# EAGLE design MAR (EAGLE 5.11)
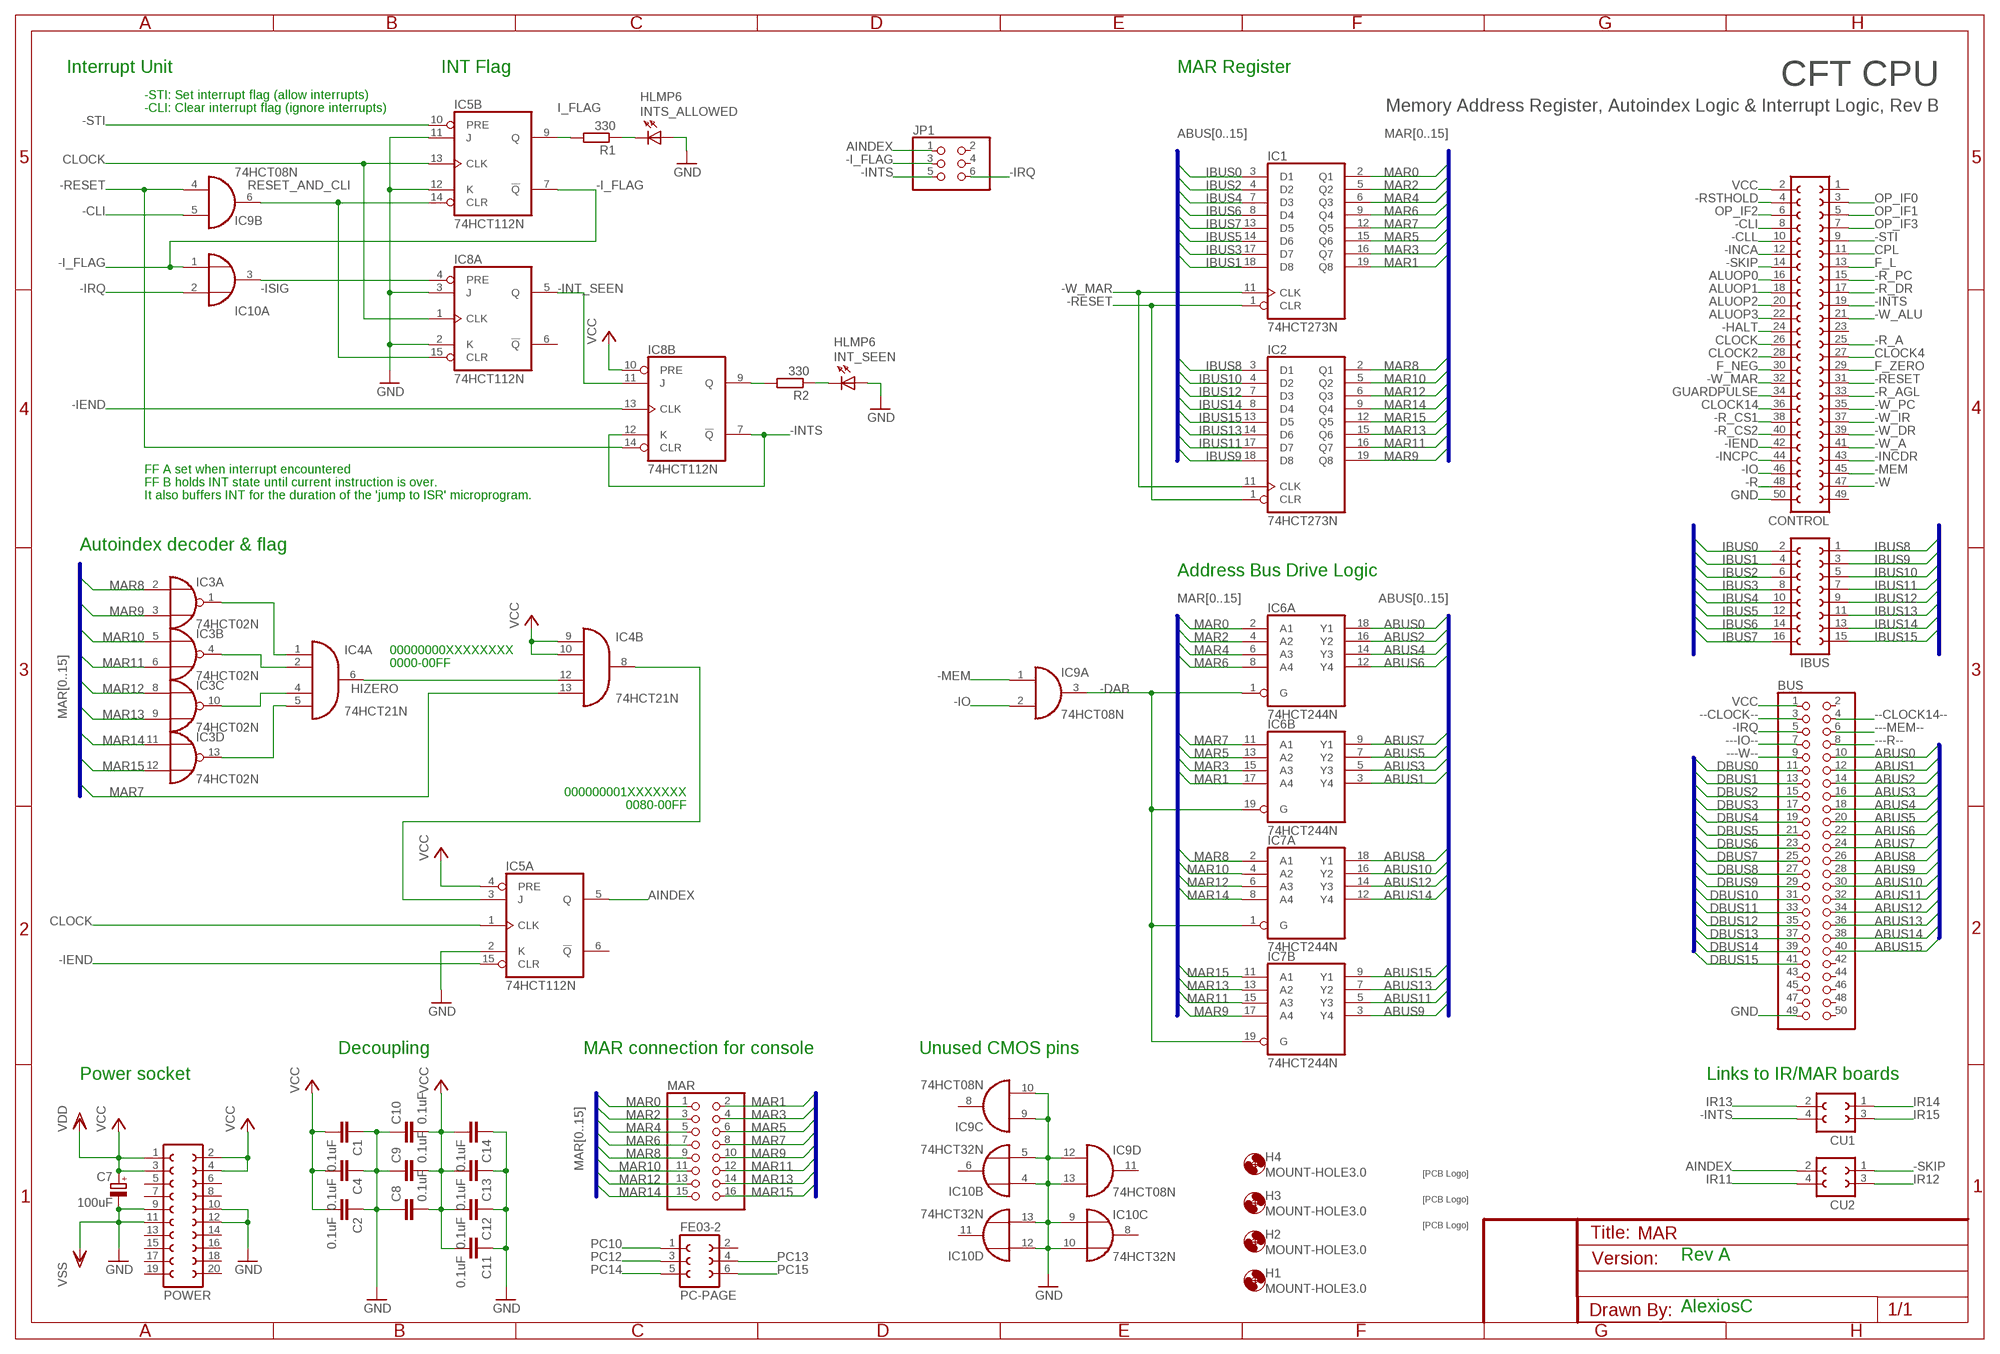
[diagram p0: schematic, sheet 1]

## Parts
BUS  PINHD-2X25/90  [2X25/90]
C1  0.1uF  C-EU025-025X050  [C025-025X050]
C2  0.1uF  C-EU025-025X050  [C025-025X050]
C4  0.1uF  C-EU025-025X050  [C025-025X050]
C7  100uF  CPOL-EUE2.5-6  [E2,5-6]
C8  0.1uF  C-EU025-025X050  [C025-025X050]
C9  0.1uF  C-EU025-025X050  [C025-025X050]
C10  0.1uF  C-EU025-025X050  [C025-025X050]
C11  0.1uF  C-EU025-025X050  [C025-025X050]
C12  0.1uF  C-EU025-025X050  [C025-025X050]
C13  0.1uF  C-EU025-025X050  [C025-025X050]
C14  0.1uF  C-EU025-025X050  [C025-025X050]
CONTROL  FE25-2  [FE25-2]
CU1  FE02-2  [FE02-2]
CU2  FE02-2  [FE02-2]
H1  MOUNT-HOLE3.0  [3,0]
H2  MOUNT-HOLE3.0  [3,0]
H3  MOUNT-HOLE3.0  [3,0]
H4  MOUNT-HOLE3.0  [3,0]
IBUS  FE08-2  [FE08-2]
IC1  74HCT273N  [DIL20]
IC2  74HCT273N  [DIL20]
IC3  74HCT02N  [DIL14]
IC4  74HCT21N  [DIL14]
IC5  74HCT112N  [DIL16]
IC6  74HCT244N  [DIL20]
IC7  74HCT244N  [DIL20]
IC8  74HCT112N  [DIL16]
IC9  74HCT08N  [DIL14]
IC10  74HCT32N  [DIL14]
INT_SEEN  HLMP6  [HLMP6]
INTS_ALLOWED  HLMP6  [HLMP6]
JP1  PINHD-2X3/90  [2X03/90]
MAR  PINHD-2X8/90  [2X08/90]
PC-PAGE  FE03-2  [FE03-2]
POWER  FE10-2  [FE10-2]
R1  330  R-EU_0204/7  [0204/7]
R2  330  R-EU_0204/7  [0204/7]
U$1  SIGNATUREPLANE  [SIGNATURE_PLANE]
U$2  SIGNATUREPLANE  [SIGNATURE_PLANE]
U$3  SIGNATURESILK  [SIGNATURE]

## Nets
---IO--: BUS.7
---MEM--: BUS.6
---R--: BUS.8
---W--: BUS.9
--CLOCK14--: BUS.4
--CLOCK--: BUS.3
-CLI: CONTROL.8 IC9.5(B:I1)
-CLL: CONTROL.10
-DAB: IC6.1(A:G) IC6.19(B:G) IC7.1(A:G) IC7.19(B:G) IC9.3(A:O)
-HALT: CONTROL.24
-I_FLAG: IC5.7(B:!Q) IC10.1(A:I0) JP1.3
-IEND: CONTROL.42 IC5.15(A:CLR) IC8.13(B:CLK)
-INCA: CONTROL.12
-INCDR: CONTROL.43
-INCPC: CONTROL.44
-INT_SEEN: IC8.5(A:Q) IC8.11(B:J)
-INTS: CONTROL.19 CU1.4 IC8.7(B:!Q) IC8.12(B:K) JP1.5
-IO: CONTROL.46 IC9.2(A:I1)
-IRQ: BUS.5 IC10.2(A:I1) JP1.6
-ISIG: IC8.4(A:PRE) IC10.3(A:O)
-MEM: CONTROL.45 IC9.1(A:I0)
-R: CONTROL.48
-R_A: CONTROL.25
-R_AGL: CONTROL.33
-R_CS1: CONTROL.38
-R_CS2: CONTROL.40
-R_DR: CONTROL.17
-R_PC: CONTROL.15
-RESET: CONTROL.31 IC1.1(CLR) IC2.1(CLR) IC8.14(B:CLR) IC9.4(B:I0)
-RSTHOLD: CONTROL.4
-SKIP: CONTROL.14 CU2.1
-STI: CONTROL.9 IC5.10(B:PRE)
-W: CONTROL.47
-W_A: CONTROL.41
-W_ALU: CONTROL.21
-W_DR: CONTROL.39
-W_IR: CONTROL.37
-W_MAR: CONTROL.32 IC1.11(CLK) IC2.11(CLK)
-W_PC: CONTROL.35
ABUS0: BUS.10 IC6.18(A:Y1)
ABUS1: BUS.12 IC6.3(B:Y4)
ABUS2: BUS.14 IC6.16(A:Y2)
ABUS3: BUS.16 IC6.5(B:Y3)
ABUS4: BUS.18 IC6.14(A:Y3)
ABUS5: BUS.20 IC6.7(B:Y2)
ABUS6: BUS.22 IC6.12(A:Y4)
ABUS7: BUS.24 IC6.9(B:Y1)
ABUS8: BUS.26 IC7.18(A:Y1)
ABUS9: BUS.28 IC7.3(B:Y4)
ABUS10: BUS.30 IC7.16(A:Y2)
ABUS11: BUS.32 IC7.5(B:Y3)
ABUS12: BUS.34 IC7.14(A:Y3)
ABUS13: BUS.36 IC7.7(B:Y2)
ABUS14: BUS.38 IC7.12(A:Y4)
ABUS15: BUS.40 IC7.9(B:Y1)
AINDEX: CU2.2 IC5.5(A:Q) JP1.1
ALUOP0: CONTROL.16
ALUOP1: CONTROL.18
ALUOP2: CONTROL.20
ALUOP3: CONTROL.22
CLOCK: CONTROL.26 IC5.1(A:CLK) IC5.13(B:CLK) IC8.1(A:CLK)
CLOCK2: CONTROL.28
CLOCK4: CONTROL.27
CLOCK14: CONTROL.36
CPL: CONTROL.11
DBUS0: BUS.11
DBUS1: BUS.13
DBUS2: BUS.15
DBUS3: BUS.17
DBUS4: BUS.19
DBUS5: BUS.21
DBUS6: BUS.23
DBUS7: BUS.25
DBUS8: BUS.27
DBUS9: BUS.29
DBUS10: BUS.31
DBUS11: BUS.33
DBUS12: BUS.35
DBUS13: BUS.37
DBUS14: BUS.39
DBUS15: BUS.41
F_L: CONTROL.13
F_NEG: CONTROL.30
F_ZERO: CONTROL.29
GND: BUS.49 C1.1 C2.1 C4.1 C7.- C8.1 C9.1 C10.1 C11.1 C12.1 C13.1 C14.1 CONTROL.50 IC5.2(A:K) IC5.11(B:J) IC5.12(B:K) IC8.2(A:K) IC8.3(A:J) IC9.9(C:I0) IC9.10(C:I1) IC9.12(D:I0) IC9.13(D:I1) IC10.4(B:I0) IC10.5(B:I1) IC10.9(C:I0) IC10.10(C:I1) IC10.12(D:I0) IC10.13(D:I1) INT_SEEN.A INTS_ALLOWED.A POWER.9 POWER.10 POWER.11 POWER.12 ; supply symbol labelled VSS
GUARDPULSE: CONTROL.34
HIZERO: IC4.6(A:O) IC4.12(B:I2)
I_FLAG: IC5.9(B:Q) R1.2
IBUS0: IBUS.2 IC1.3(D1)
IBUS1: IBUS.4 IC1.18(D8)
IBUS2: IBUS.6 IC1.4(D2)
IBUS3: IBUS.8 IC1.17(D7)
IBUS4: IBUS.10 IC1.7(D3)
IBUS5: IBUS.12 IC1.14(D6)
IBUS6: IBUS.14 IC1.8(D4)
IBUS7: IBUS.16 IC1.13(D5)
IBUS8: IBUS.1 IC2.3(D1)
IBUS9: IBUS.3 IC2.18(D8)
IBUS10: IBUS.5 IC2.4(D2)
IBUS11: IBUS.7 IC2.17(D7)
IBUS12: IBUS.9 IC2.7(D3)
IBUS13: IBUS.11 IC2.14(D6)
IBUS14: IBUS.13 IC2.8(D4)
IBUS15: IBUS.15 IC2.13(D5)
INTS: IC8.9(B:Q) R2.2
IR11: CU2.4
IR12: CU2.3
IR13: CU1.2
IR14: CU1.1
IR15: CU1.3
MAR0: IC1.2(Q1) IC6.2(A:A1) MAR.1
MAR1: IC1.19(Q8) IC6.17(B:A4) MAR.2
MAR2: IC1.5(Q2) IC6.4(A:A2) MAR.3
MAR3: IC1.16(Q7) IC6.15(B:A3) MAR.4
MAR4: IC1.6(Q3) IC6.6(A:A3) MAR.5
MAR5: IC1.15(Q6) IC6.13(B:A2) MAR.6
MAR6: IC1.9(Q4) IC6.8(A:A4) MAR.7
MAR7: IC1.12(Q5) IC4.13(B:I3) IC6.11(B:A1) MAR.8
MAR8: IC2.2(Q1) IC3.2(A:I0) IC7.2(A:A1) MAR.9
MAR9: IC2.19(Q8) IC3.3(A:I1) IC7.17(B:A4) MAR.10
MAR10: IC2.5(Q2) IC3.5(B:I0) IC7.4(A:A2) MAR.11
MAR11: IC2.16(Q7) IC3.6(B:I1) IC7.15(B:A3) MAR.12
MAR12: IC2.6(Q3) IC3.8(C:I0) IC7.6(A:A3) MAR.13
MAR13: IC2.15(Q6) IC3.9(C:I1) IC7.13(B:A2) MAR.14
MAR14: IC2.9(Q4) IC3.11(D:I0) IC7.8(A:A4) MAR.15
MAR15: IC2.12(Q5) IC3.12(D:I1) IC7.11(B:A1) MAR.16
N$1: IC3.1(A:O) IC4.1(A:I0)
N$2: IC3.4(B:O) IC4.2(A:I1)
N$3: IC3.10(C:O) IC4.4(A:I2)
N$4: IC3.13(D:O) IC4.5(A:I3)
N$5: IC4.8(B:O) IC5.3(A:J)
N$6: INT_SEEN.K R2.1
N$7: INTS_ALLOWED.K R1.1
OP_IF0: CONTROL.3
OP_IF1: CONTROL.5
OP_IF2: CONTROL.6
OP_IF3: CONTROL.7
PC10: PC-PAGE.1
PC12: PC-PAGE.3
PC13: PC-PAGE.4
PC14: PC-PAGE.5
PC15: PC-PAGE.6
RESET_AND_CLI: IC5.14(B:CLR) IC8.15(A:CLR) IC9.6(B:O)
VCC: BUS.1 C1.2 C2.2 C4.2 C7.+ C8.2 C9.2 C10.2 C11.2 C12.2 C13.2 C14.2 CONTROL.2 IC4.9(B:I0) IC4.10(B:I1) IC5.4(A:PRE) IC8.10(B:PRE) POWER.1 POWER.2 POWER.3 POWER.4 ; supply symbol labelled VDD
Unconnected: BUS.2 BUS.42 BUS.43 BUS.44 BUS.45 BUS.46 BUS.47 BUS.48 BUS.50 CONTROL.1 CONTROL.23 CONTROL.49 IC5.6(A:!Q) IC8.6(A:!Q) IC9.8(C:O) IC9.11(D:O) IC10.6(B:O) IC10.8(C:O) IC10.11(D:O) JP1.2 JP1.4 PC-PAGE.2 POWER.5 POWER.6 POWER.7 POWER.8 POWER.13 POWER.14 POWER.15 POWER.16 POWER.17 POWER.18 POWER.19 POWER.20

## Buses
IBUS[0..15]
MAR[0..15]
ABUS[0..15]
DBUS[0..15]

## Notes on the sheet
- Interrupt Unit | INT Flag | MAR Register
- CFT CPU
- -STI: Set interrupt flag (allow interrupts)
- -CLI: Clear interrupt flag (ignore interrupts) | Memory Address Register, Autoindex Logic & Interrupt Logic, Rev B
- FF A set when interrupt encountered
- FF B holds INT state until current instruction is over.
- It also buffers INT for the duration of the 'jump to ISR' microprogram.
- Autoindex decoder & flag
- Address Bus Drive Logic
- 00000000XXXXXXXX
- 0000-00FF
- 000000001XXXXXXX
- 0080-00FF
- Decoupling | MAR connection for console | Unused CMOS pins
- Power socket | Links to IR/MAR boards
- Rev A
- AlexiosC

## Power pins joined to a net without a drawn wire
GND: IC1.10(GND) IC2.10(GND) IC3.7(P:GND) IC4.7(P:GND) IC5.8(P:GND) IC6.10(P:GND) IC7.10(P:GND) IC8.8(P:GND) IC9.7(P:GND) IC10.7(P:GND)
VCC: IC1.20(VCC) IC2.20(VCC) IC3.14(P:VCC) IC4.14(P:VCC) IC5.16(P:VCC) IC6.20(P:VCC) IC7.20(P:VCC) IC8.16(P:VCC) IC9.14(P:VCC) IC10.14(P:VCC)

## Library data of the parts
BUS = pinhead:PINHD-2X25: PIN HEADER
C1 C2 C4 C8-C14 = rcl:C-EU: CAPACITOR, European symbol
C7 = rcl:CPOL-EU: POLARIZED CAPACITOR, European symbol
CONTROL = con-lsta:FE25-2: FEMALE HEADER
CU1 CU2 = alexios:FE02-2: A 2x2 pin female header.
H1-H4 = holes:MOUNT-HOLE: MOUNTING HOLE with drill center marker
IBUS = con-lsta:FE08-2: FEMALE HEADER
IC1 IC2 = 74xx-eu:74*273: Octal D type FLIP FLOP, clear
IC3 = 74xx-eu:74*02: Quad 2-input NOR gate
IC4 = 74xx-eu:74*21: Dual 4-input AND gate
IC5 IC8 = 74xx-eu:74*112: Dual J-K negative edge triggered FLIP FLOP, preset and clear
IC6 IC7 = 74xx-eu:74*244: Octal BUFFER and LINE DRIVER, 3-state
IC9 = 74xx-eu:74*08: Quad 2-input AND gate
IC10 = 74xx-eu:74*32: Quad 2-input OR gate
INT_SEEN INTS_ALLOWED = display-hp:HLMP6: LED 2mm horizontal; MF: AGILENT TECHNOLOGIES; MPN: HLMP-6500; OC_FARNELL: 1652490; OC_NEWARK: 40K0088
JP1 = pinhead:PINHD-2X3: PIN HEADER
MAR = pinhead:PINHD-2X8: PIN HEADER
PC-PAGE = alexios:FE03-2: A 2x3 female header.
POWER = con-lsta:FE10-2: FEMALE HEADER; OC_FARNELL: unknown; OC_NEWARK: unknown
R1 R2 = resistor:R-EU_: RESISTOR, European symbol
U$1-U$3 = alexios:SIGNATURE: Soup signature

## Net classes
0 default: width 0.406 mm, clearance 0.305 mm
1 Decoupling: width 1.27 mm

## Board
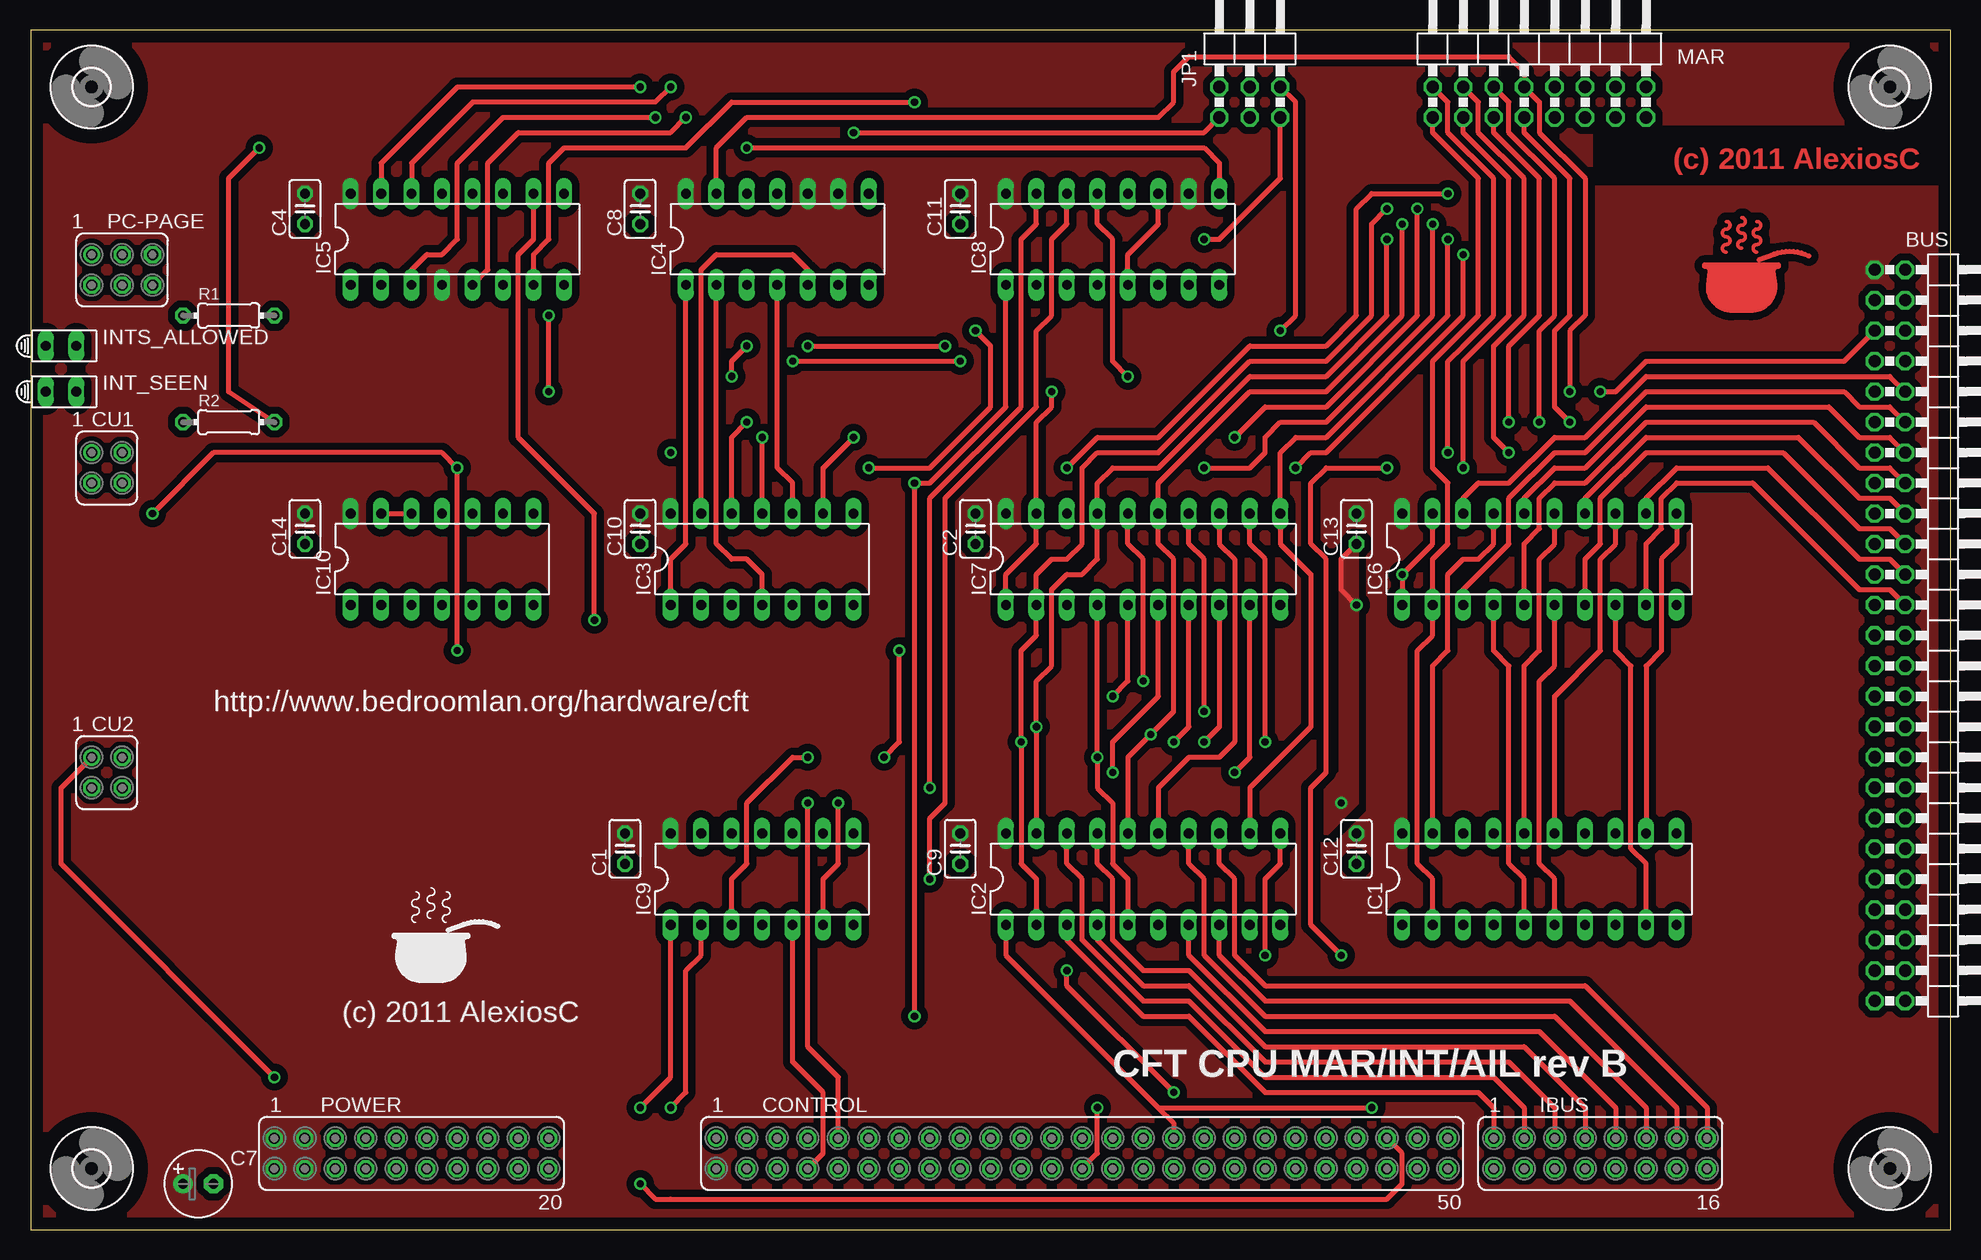
[diagram p1: board, top side]
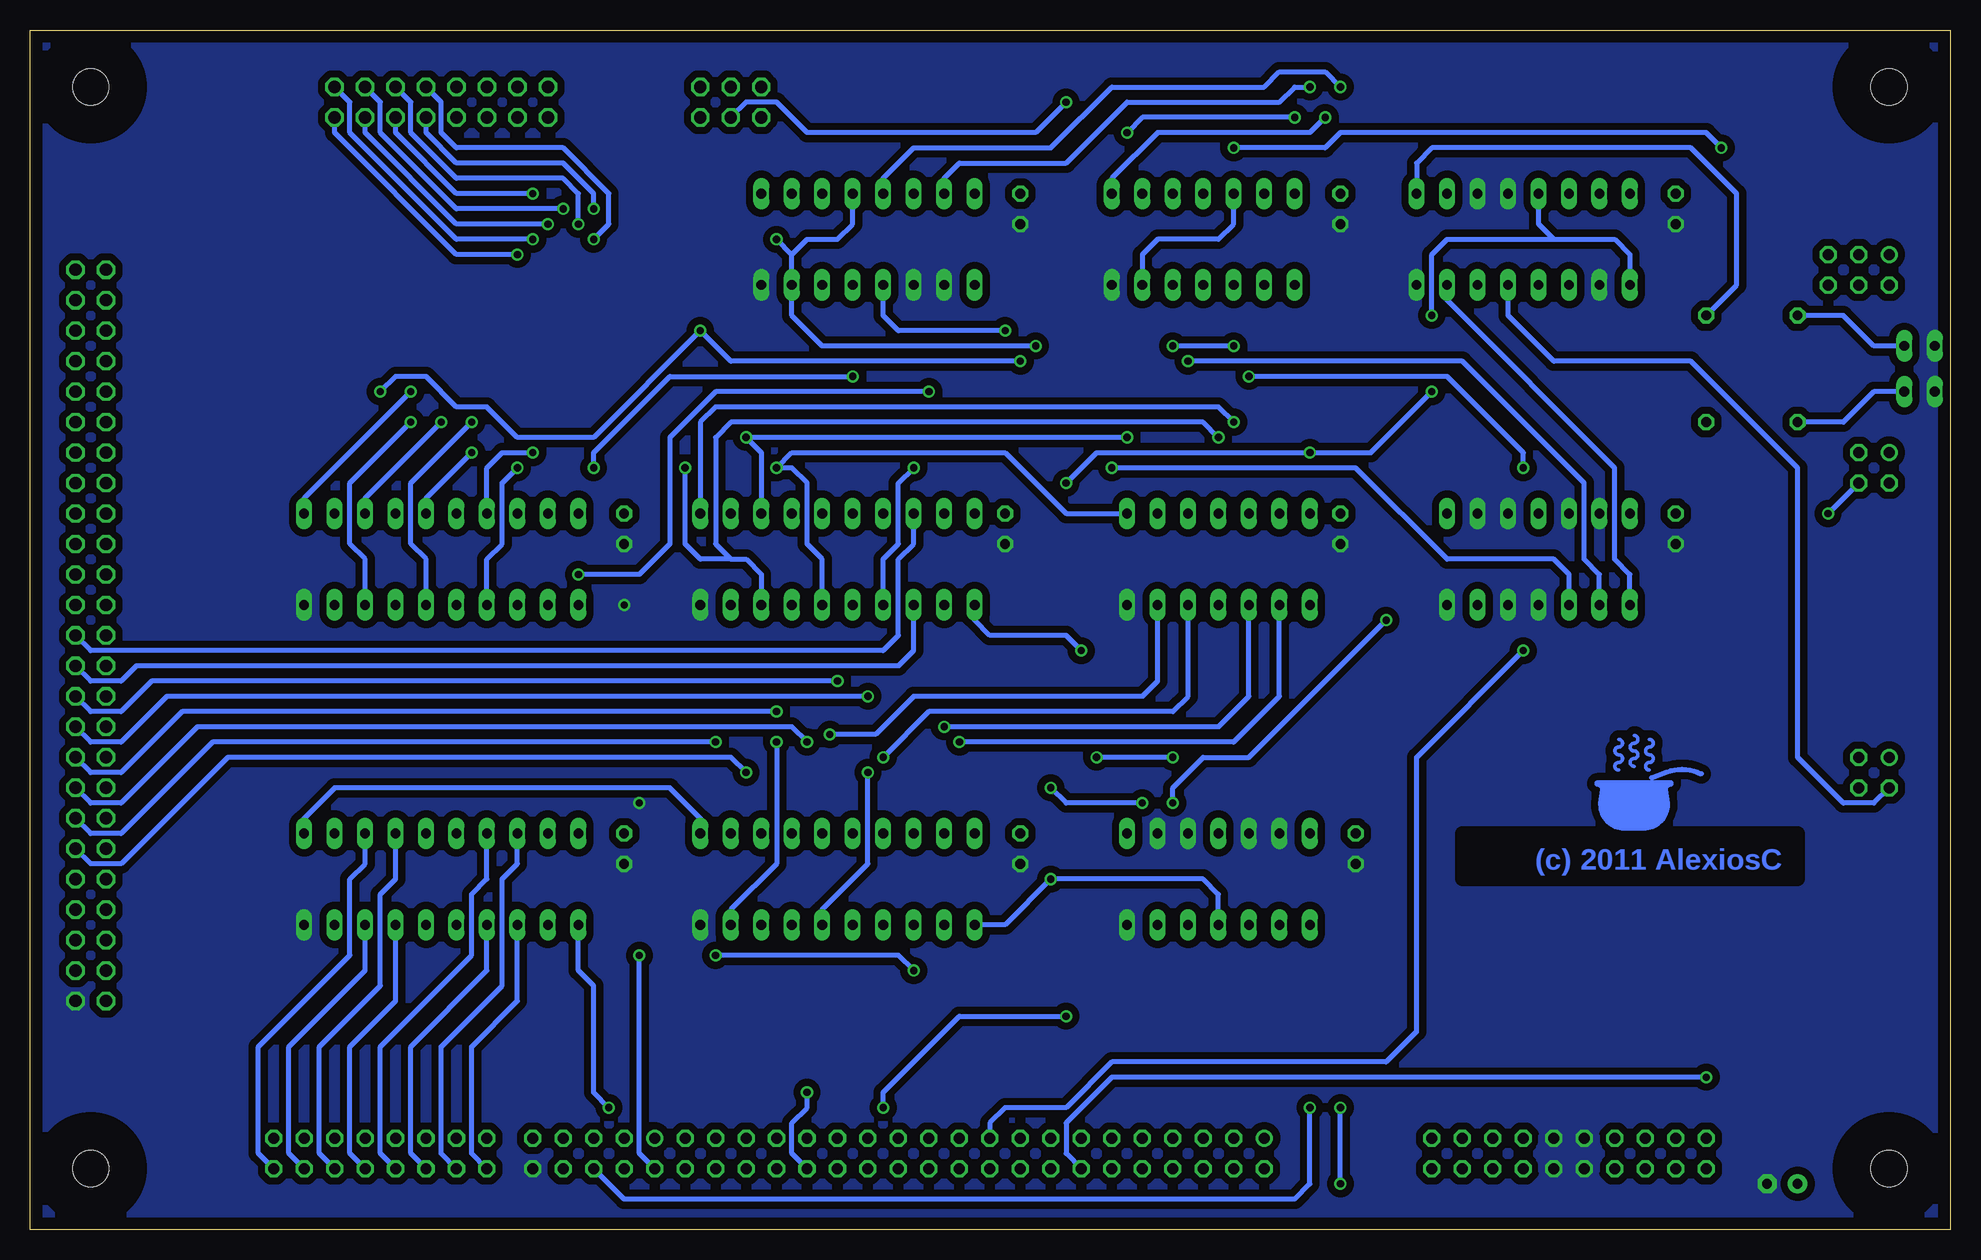
[diagram p2: board, bottom side, seen from below]

Size 160 x 100 mm. Coordinates in mm from the lower left corner, seen from the top.
Outline: 0,0 160,0 160,100 0,100 0,0
Copper layers (1*16): Top 0.035mm / dielectric 1.5mm / Bottom 0.035mm
Design rules "olimex-10mil": minimum track width 10mil, minimum drill 24mil, track to track 10mil, track to pad 10mil, pad to pad 10mil, via to via 10mil, smd to smd 10mil, copper to edge 40mil, drill to drill 10mil, minimum pad ring 10mil, minimum via ring 8mil, stop-mask expansion 0mil, vias tented up to drill 0mil, thermal gap 10mil
tRestrict: area 130.8,87.6 to 158.8,91.4
bRestrict: area 12.7,29.2 to 40.6,33

### Footprints (pad centres in the part's own frame; a part is rotated, then mirrored left to right if it is on the bottom)
2X25/90 = drill 1.016 octagon: 1 -29.21,-6.35; 2 -29.21,-3.81; 3 -26.67,-6.35; 4 -26.67,-3.81; 5 -24.13,-6.35; 6 -24.13,-3.81; 7 -21.59,-6.35; 8 -21.59,-3.81; 9 -19.05,-6.35; 10 -19.05,-3.81; 11 -16.51,-6.35; 12 -16.51,-3.81; 13 -13.97,-6.35; 14 -13.97,-3.81; 15 -11.43,-6.35; 16 -11.43,-3.81; 17 -8.89,-6.35; 18 -8.89,-3.81; 19 -6.35,-6.35; 20 -6.35,-3.81; 21 -3.81,-6.35; 22 -3.81,-3.81; 23 -1.27,-6.35; 24 -1.27,-3.81; 25 1.27,-6.35; 26 1.27,-3.81; 27 3.81,-6.35; 28 3.81,-3.81; 29 6.35,-6.35; 30 6.35,-3.81; 31 8.89,-6.35; 32 8.89,-3.81; 33 11.43,-6.35; 34 11.43,-3.81; 35 13.97,-6.35; 36 13.97,-3.81; 37 16.51,-6.35; 38 16.51,-3.81; 39 19.05,-6.35; 40 19.05,-3.81; 41 21.59,-3.81; 42 21.59,-6.35; 43 24.13,-3.81; 44 24.13,-6.35; 45 26.67,-3.81; 46 26.67,-6.35; 47 29.21,-3.81; 48 29.21,-6.35; 49 31.75,-3.81; 50 31.75,-6.35
C025-025X050 = drill 0.813 octagon: 1 -1.27,0; 2 1.27,0
E2,5-6 = drill 0.813 pad 1.6 round: + -1.27,0 | drill 0.813 pad 1.6 octagon: - 1.27,0
FE25-2 = drill 0.914 round: 1 -30.48,1.27; 41 20.32,1.27 | drill 0.914 octagon: 2 -30.48,-1.27; 3 -27.94,1.27; 4 -27.94,-1.27; 5 -25.4,1.27; 6 -25.4,-1.27; 7 -22.86,1.27; 8 -22.86,-1.27; 9 -20.32,1.27; 10 -20.32,-1.27; 11 -17.78,1.27; 12 -17.78,-1.27; 13 -15.24,1.27; 14 -15.24,-1.27; 15 -12.7,1.27; 16 -12.7,-1.27; 17 -10.16,1.27; 18 -10.16,-1.27; 19 -7.62,1.27; 20 -7.62,-1.27; 21 -5.08,1.27; 22 -5.08,-1.27; 23 -2.54,1.27; 24 -2.54,-1.27; 25 0,1.27; 26 0,-1.27; 27 2.54,1.27; 28 2.54,-1.27; 29 5.08,1.27; 30 5.08,-1.27; 31 7.62,1.27; 32 7.62,-1.27; 33 10.16,1.27; 34 10.16,-1.27; 35 12.7,1.27; 36 12.7,-1.27; 37 15.24,1.27; 38 15.24,-1.27; 39 17.78,1.27; 40 17.78,-1.27; 42 20.32,-1.27; 43 22.86,1.27; 44 22.86,-1.27; 45 25.4,1.27; 46 25.4,-1.27; 47 27.94,1.27; 48 27.94,-1.27; 49 30.48,1.27; 50 30.48,-1.27
FE02-2 = drill 0.914 round: 1 -1.27,1.27 | drill 0.914 octagon: 2 -1.27,-1.27; 3 1.27,1.27; 4 1.27,-1.27
3,0 = hole 3: 0,0
FE08-2 = drill 0.914 octagon: 1 -8.89,1.27; 2 -8.89,-1.27; 3 -6.35,1.27; 4 -6.35,-1.27; 5 -3.81,1.27; 6 -3.81,-1.27; 7 -1.27,1.27; 8 -1.27,-1.27; 9 1.27,1.27; 10 1.27,-1.27; 11 3.81,1.27; 12 3.81,-1.27; 13 6.35,1.27; 14 6.35,-1.27; 15 8.89,1.27; 16 8.89,-1.27
DIL20 = drill 0.813 long: 1 -11.43,-3.81; 2 -8.89,-3.81; 3 -6.35,-3.81; 4 -3.81,-3.81; 5 -1.27,-3.81; 6 1.27,-3.81; 7 3.81,-3.81; 8 6.35,-3.81; 9 8.89,-3.81; 10 11.43,-3.81; 11 11.43,3.81; 12 8.89,3.81; 13 6.35,3.81; 14 3.81,3.81; 15 1.27,3.81; 16 -1.27,3.81; 17 -3.81,3.81; 18 -6.35,3.81; 19 -8.89,3.81; 20 -11.43,3.81
DIL14 = drill 0.813 long: 1 -7.62,-3.81; 2 -5.08,-3.81; 3 -2.54,-3.81; 4 0,-3.81; 5 2.54,-3.81; 6 5.08,-3.81; 7 7.62,-3.81; 8 7.62,3.81; 9 5.08,3.81; 10 2.54,3.81; 11 0,3.81; 12 -2.54,3.81; 13 -5.08,3.81; 14 -7.62,3.81
DIL16 = drill 0.813 long: 1 -8.89,-3.81; 2 -6.35,-3.81; 3 -3.81,-3.81; 4 -1.27,-3.81; 5 1.27,-3.81; 6 3.81,-3.81; 7 6.35,-3.81; 8 8.89,-3.81; 9 8.89,3.81; 10 6.35,3.81; 11 3.81,3.81; 12 1.27,3.81; 13 -1.27,3.81; 14 -3.81,3.81; 15 -6.35,3.81; 16 -8.89,3.81
HLMP6 = drill 0.813 long: A -1.27,0; K 1.27,0
2X03/90 = drill 1.016 octagon: 1 -2.54,-6.35; 2 -2.54,-3.81; 3 0,-6.35; 4 0,-3.81; 5 2.54,-6.35; 6 2.54,-3.81
2X08/90 = drill 1.016 octagon: 1 -8.89,-6.35; 2 -8.89,-3.81; 3 -6.35,-6.35; 4 -6.35,-3.81; 5 -3.81,-6.35; 6 -3.81,-3.81; 7 -1.27,-6.35; 8 -1.27,-3.81; 9 1.27,-6.35; 10 1.27,-3.81; 11 3.81,-6.35; 12 3.81,-3.81; 13 6.35,-6.35; 14 6.35,-3.81; 15 8.89,-6.35; 16 8.89,-3.81
FE03-2 = drill 0.914 round: 1 -2.54,1.27 | drill 0.914 octagon: 2 -2.54,-1.27; 3 0,1.27; 4 0,-1.27; 5 2.54,1.27; 6 2.54,-1.27
FE10-2 = drill 0.914 octagon: 1 -11.43,1.27; 2 -11.43,-1.27; 3 -8.89,1.27; 4 -8.89,-1.27; 5 -6.35,1.27; 6 -6.35,-1.27; 7 -3.81,1.27; 8 -3.81,-1.27; 9 -1.27,1.27; 10 -1.27,-1.27; 11 1.27,1.27; 12 1.27,-1.27; 13 3.81,1.27; 14 3.81,-1.27; 15 6.35,1.27; 16 6.35,-1.27; 17 8.89,1.27; 18 8.89,-1.27; 19 11.43,1.27; 20 11.43,-1.27
0204/7 = drill 0.813 octagon: 1 -3.81,0; 2 3.81,0

### Placement (x,y rotation side)
BUS  160.02,50.8 270 top
C1  49.53,31.75 90 top
C2  78.74,58.42 90 top
C4  22.86,85.09 90 top
C7  13.97,3.81 0 top
C8  50.8,85.09 90 top
C9  77.47,31.75 90 top
C10  50.8,58.42 90 top
C11  77.47,85.09 90 top
C12  110.49,31.75 90 top
C13  110.49,58.42 90 top
C14  22.86,58.42 90 top
CONTROL  87.63,6.35 0 top
CU1  6.35,63.5 0 top
CU2  6.35,38.1 0 top
H1  154.94,95.25 0 top
H2  154.94,5.08 0 top
H3  5.08,5.08 0 top
H4  5.08,95.25 0 top
IBUS  130.81,6.35 0 top
IC1  125.73,29.21 0 top
IC2  92.71,29.21 0 top
IC3  60.96,55.88 0 top
IC4  62.23,82.55 0 top
IC5  35.56,82.55 0 top
IC6  125.73,55.88 0 top
IC7  92.71,55.88 0 top
IC8  90.17,82.55 0 top
IC9  60.96,29.21 0 top
IC10  34.29,55.88 0 top
INT_SEEN  2.54,69.85 0 top
INTS_ALLOWED  2.54,73.66 0 top
JP1  101.6,99.06 0 top
MAR  125.73,99.06 0 top
PC-PAGE  7.62,80.01 0 top
POWER  31.75,6.35 0 top
R1  16.51,76.2 0 top
R2  16.51,67.31 0 top
U$1  139.7,76.2 0 top
U$2  29.21,33.02 0 bottom
U$3  30.48,20.32 0 top

### Tracks (layer width: path | path; a pad name or v marks a point on that pad's centre or on a via)
-CLI
  Top 0.406: CONTROL.8 66.04,6.35 66.04,11.43 63.5,13.97 IC9.5
-DAB  (via drill 0.6)
  Top 0.406: IC6.1 v114.3,54.61 116.84,57.15 IC6.19 | IC7.1 81.28,54.61 83.82,57.15 IC7.19 83.82,67.31 85.09,68.58 v85.09,69.85 | IC9.3 58.42,29.21 59.69,30.48 59.69,35.56 63.5,39.37 v64.77,39.37 | v71.12,39.37 72.39,40.64 v72.39,48.26
  Bottom 0.406: v72.39,48.26 73.66,49.53 80.01,49.53 81.28,50.8 IC7.1 | v64.77,39.37 v71.12,39.37 | v114.3,54.61 109.22,54.61 106.68,57.15 106.68,66.04 102.87,69.85 v85.09,69.85
-I_FLAG  (via drill 0.6)
  Top 0.406: v73.66,93.98 58.42,93.98 54.61,90.17 44.45,90.17 43.18,88.9 43.18,82.55 41.91,81.28 IC5.7
  Bottom 0.406: IC10.1 26.67,54.61 27.94,55.88 27.94,63.5 41.91,77.47 IC5.7 | v73.66,93.98 76.2,91.44 95.25,91.44 97.79,93.98 100.33,93.98 JP1.3
-IEND  (via drill 0.6)
  Top 0.406: IC5.15 29.21,88.9 35.56,95.25 v50.8,95.25 | v109.22,22.86 106.68,25.4 106.68,36.83 107.95,38.1 107.95,55.88 106.68,57.15 106.68,62.23 107.95,63.5 v113.03,63.5 | v91.44,71.12 90.17,72.39 90.17,82.55 88.9,83.82 IC8.13
  Bottom 0.406: IC8.13 88.9,87.63 86.36,90.17 74.93,90.17 69.85,95.25 57.15,95.25 55.88,96.52 52.07,96.52 v50.8,95.25 | CONTROL.42 109.22,6.35 v109.22,22.86 | v113.03,63.5 113.03,64.77 106.68,71.12 v91.44,71.12
-INT_SEEN
  Top 0.406: IC8.11 93.98,83.82 91.44,81.28 IC8.5
-INTS  (via drill 0.6)
  Top 0.406: v97.79,82.55 99.06,82.55 104.14,87.63 JP1.5 | v59.69,73.66 58.42,72.39 v58.42,71.12 | v10.16,59.69 15.24,64.77 34.29,64.77 v35.56,63.5 v35.56,48.26 | v64.77,73.66 v76.2,73.66
  Bottom 0.406: IC8.12 91.44,83.82 92.71,82.55 95.25,82.55 96.52,81.28 | 96.52,81.28 IC8.7 96.52,76.2 93.98,73.66 v76.2,73.66 | 96.52,81.28 v97.79,82.55 | v35.56,63.5 35.56,64.77 41.91,71.12 v58.42,71.12 | v10.16,59.69 CU1.4 | v59.69,73.66 v64.77,73.66 | CONTROL.19 80.01,8.89 78.74,10.16 73.66,10.16 69.85,13.97 46.99,13.97 44.45,16.51 44.45,39.37 v35.56,48.26
-IO  (via drill 0.6)
  Top 0.406: v53.34,10.16 54.61,11.43 54.61,21.59 55.88,22.86 IC9.2
  Bottom 0.406: CONTROL.46 110.49,2.54 54.61,2.54 53.34,3.81 v53.34,10.16
-IRQ  (via drill 0.6)
  Top 0.406: v104.14,74.93 105.41,76.2 105.41,93.98 JP1.6 | v130.81,69.85 132.08,69.85 134.62,72.39 151.13,72.39 BUS.5 | v63.5,72.39 v77.47,72.39
  Bottom 0.406: IC10.2 29.21,54.61 30.48,55.88 30.48,62.23 40.64,72.39 v63.5,72.39 | v130.81,69.85 129.54,71.12 127,71.12 124.46,68.58 121.92,68.58 119.38,66.04 113.03,66.04 v104.14,74.93 101.6,72.39 v77.47,72.39
-ISIG  (via drill 0.6)
  Top 0.406: v69.85,63.5 74.93,63.5 80.01,68.58 80.01,73.66 v78.74,74.93
  Bottom 0.406: IC10.3 31.75,54.61 33.02,55.88 41.91,55.88 49.53,63.5 v69.85,63.5 | v78.74,74.93 87.63,74.93 88.9,76.2 IC8.4
-MEM  (via drill 0.6)
  Top 0.406: IC9.1 53.34,12.7 v50.8,10.16 | v50.8,3.81 52.07,2.54 53.34,2.54 113.03,2.54 114.3,3.81 114.3,6.35 CONTROL.45
  Bottom 0.406: v50.8,3.81 v50.8,10.16
-RESET  (via drill 0.6)
  Top 0.406: 93.98,10.16 v111.76,10.16 | 93.98,10.16 81.28,22.86 IC2.1 | CONTROL.31 95.25,8.89 93.98,10.16 | IC8.14 86.36,83.82 85.09,82.55 85.09,76.2 83.82,74.93 83.82,68.58 76.2,60.96 76.2,35.56 74.93,34.29 v74.93,29.21
  Bottom 0.406: v111.76,10.16 113.03,11.43 113.03,20.32 114.3,21.59 IC1.1 | IC2.1 78.74,25.4 v74.93,29.21 62.23,29.21 60.96,27.94 IC9.4
-SKIP  (via drill 0.6)
  Top 0.406: v20.32,12.7 2.54,30.48 2.54,36.83 CU2.1
  Bottom 0.406: CONTROL.14 73.66,6.35 73.66,8.89 69.85,12.7 v20.32,12.7
-STI  (via drill 0.6)
  Top 0.406: CONTROL.9 67.31,12.7 64.77,15.24 v64.77,35.56 | v46.99,50.8 46.99,59.69 40.64,66.04 40.64,81.28 41.91,82.55 IC5.10
  Bottom 0.406: v64.77,35.56 64.77,36.83 62.23,39.37 58.42,39.37 v46.99,50.8
-W_MAR  (via drill 0.6)
  Top 0.406: v102.87,22.86 102.87,29.21 104.14,30.48 IC2.11 | v95.25,11.43 86.36,20.32 v86.36,21.59
  Bottom 0.406: IC1.11 137.16,34.29 134.62,36.83 106.68,36.83 104.14,34.29 IC2.11 | CONTROL.32 96.52,6.35 96.52,8.89 95.25,10.16 v95.25,11.43 | v86.36,21.59 87.63,22.86 v102.87,22.86
ABUS0
  Top 0.406: IC6.18 119.38,60.96 120.65,62.23 123.19,62.23 127,66.04 129.54,66.04 134.62,71.12 154.94,71.12 BUS.10
ABUS1
  Top 0.406: IC6.3 119.38,53.34 123.19,57.15 123.19,60.96 127,64.77 129.54,64.77 134.62,69.85 151.13,69.85 152.4,68.58 154.94,68.58 BUS.12
ABUS2
  Top 0.406: IC6.16 124.46,60.96 127,63.5 129.54,63.5 134.62,68.58 149.86,68.58 152.4,66.04 154.94,66.04 BUS.14
ABUS3
  Top 0.406: IC6.5 124.46,57.15 125.73,58.42 125.73,60.96 127,62.23 129.54,62.23 134.62,67.31 148.59,67.31 152.4,63.5 154.94,63.5 BUS.16
ABUS4
  Top 0.406: IC6.14 129.54,60.96 134.62,66.04 147.32,66.04 152.4,60.96 154.94,60.96 BUS.18
ABUS5
  Top 0.406: IC6.7 129.54,55.88 130.81,57.15 130.81,60.96 134.62,64.77 146.05,64.77 152.4,58.42 154.94,58.42 BUS.20
ABUS6
  Top 0.406: IC6.12 134.62,60.96 137.16,63.5 144.78,63.5 152.4,55.88 154.94,55.88 BUS.22
ABUS7
  Top 0.406: IC6.9 134.62,57.15 135.89,58.42 135.89,60.96 137.16,62.23 143.51,62.23 152.4,53.34 154.94,53.34 BUS.24
ABUS8
  Bottom 0.406: BUS.26 154.94,48.26 88.9,48.26 87.63,49.53 87.63,55.88 86.36,57.15 IC7.18
ABUS9
  Bottom 0.406: BUS.28 154.94,45.72 152.4,45.72 151.13,46.99 87.63,46.99 86.36,48.26 IC7.3
ABUS10  (via drill 0.6)
  Top 0.406: v92.71,45.72 92.71,55.88 91.44,57.15 IC7.16
  Bottom 0.406: BUS.30 154.94,43.18 152.4,43.18 149.86,45.72 v92.71,45.72
ABUS11  (via drill 0.6)
  Top 0.406: v90.17,44.45 91.44,45.72 IC7.5
  Bottom 0.406: BUS.32 154.94,40.64 152.4,40.64 148.59,44.45 v90.17,44.45
ABUS12  (via drill 0.6)
  Top 0.406: v97.79,43.18 97.79,55.88 96.52,57.15 IC7.14
  Bottom 0.406: BUS.34 154.94,38.1 152.4,38.1 147.32,43.18 v97.79,43.18
ABUS13  (via drill 0.6)
  Top 0.406: v95.25,40.64 96.52,41.91 IC7.7
  Bottom 0.406: BUS.36 154.94,35.56 152.4,35.56 146.05,41.91 96.52,41.91 v95.25,40.64
ABUS14  (via drill 0.6)
  Top 0.406: v102.87,40.64 102.87,55.88 101.6,57.15 IC7.12
  Bottom 0.406: BUS.38 154.94,33.02 152.4,33.02 144.78,40.64 v102.87,40.64
ABUS15  (via drill 0.6)
  Top 0.406: v100.33,38.1 101.6,39.37 IC7.9
  Bottom 0.406: BUS.40 154.94,30.48 152.4,30.48 143.51,39.37 101.6,39.37 v100.33,38.1
AINDEX  (via drill 0.6)
  Top 0.406: IC5.5 38.1,80.01 38.1,88.9 40.64,91.44 53.34,91.44 v54.61,92.71 | v68.58,91.44 97.79,91.44 JP1.1
  Bottom 0.406: CU2.2 6.35,35.56 8.89,35.56 12.7,39.37 12.7,63.5 21.59,72.39 33.02,72.39 36.83,76.2 IC5.5 | v54.61,92.71 67.31,92.71 v68.58,91.44
CLOCK  (via drill 0.6)
  Top 0.406: CONTROL.26 88.9,6.35 v88.9,10.16 | v73.66,17.78 v73.66,62.23 74.93,62.23 81.28,68.58 IC8.1 | v43.18,69.85 v43.18,76.2
  Bottom 0.406: IC5.1 26.67,81.28 27.94,82.55 33.02,82.55 | 33.02,82.55 34.29,83.82 IC5.13 | v88.9,10.16 88.9,11.43 82.55,17.78 v73.66,17.78 | v73.66,62.23 71.12,64.77 v53.34,64.77 48.26,64.77 v43.18,69.85 | 33.02,82.55 41.91,82.55 43.18,81.28 v43.18,76.2
GND  (via drill 0.6)
  Top 0.406: IC10.13 IC10.12 | v110.49,52.07 109.22,53.34 109.22,55.88 C13.1
  other vias: 109.22,35.56
  pour Bottom (isolate 0.508, no thermals): 30.48,8.89 29.21,7.62 29.21,5.08 30.48,3.81 33.02,3.81 34.29,5.08 34.29,7.62 33.02,8.89
  pour Bottom (isolate 0.61, no thermals): 0,100.33 0,0 160.02,0 160.02,100.33
  pour Top (isolate 0.61, rank 2, no thermals): 109.22,55.88 110.49,57.15 110.49,35.56 107.95,33.02 107.95,36.83 109.22,38.1
HIZERO
  Bottom 0.406: IC4.12 59.69,83.82 60.96,82.55 66.04,82.55 67.31,81.28 IC4.6
I_FLAG
  Bottom 0.406: R1.2 17.78,78.74 17.78,86.36 21.59,90.17 43.18,90.17 44.45,88.9 IC5.9
IBUS0
  Bottom 0.406: IBUS.2 123.19,6.35 123.19,15.24 119.38,19.05 IC1.3
IBUS1
  Bottom 0.406: IBUS.4 125.73,6.35 125.73,15.24 120.65,20.32 120.65,29.21 119.38,30.48 IC1.18
IBUS2
  Bottom 0.406: IBUS.6 128.27,6.35 128.27,15.24 121.92,21.59 IC1.4
IBUS3
  Bottom 0.406: IBUS.8 130.81,6.35 130.81,15.24 123.19,22.86 123.19,27.94 121.92,29.21 IC1.17
IBUS4
  Bottom 0.406: IBUS.10 133.35,6.35 133.35,15.24 129.54,19.05 IC1.7
IBUS5
  Bottom 0.406: IBUS.12 135.89,6.35 135.89,15.24 130.81,20.32 130.81,27.94 129.54,29.21 IC1.14
IBUS6
  Bottom 0.406: IBUS.14 138.43,6.35 138.43,15.24 132.08,21.59 IC1.8
IBUS7
  Bottom 0.406: IBUS.16 140.97,6.35 140.97,15.24 133.35,22.86 133.35,29.21 132.08,30.48 IC1.13
IBUS8
  Top 0.406: IBUS.1 121.92,10.16 120.65,11.43 102.87,11.43 96.52,17.78 92.71,17.78 86.36,24.13 IC2.3
IBUS9
  Top 0.406: IBUS.3 124.46,10.16 121.92,12.7 102.87,12.7 96.52,19.05 92.71,19.05 87.63,24.13 87.63,29.21 86.36,30.48 IC2.18
IBUS10
  Top 0.406: IBUS.5 127,10.16 123.19,13.97 102.87,13.97 96.52,20.32 92.71,20.32 88.9,24.13 IC2.4
IBUS11
  Top 0.406: IBUS.7 129.54,10.16 124.46,15.24 102.87,15.24 96.52,21.59 92.71,21.59 90.17,24.13 90.17,29.21 88.9,30.48 IC2.17
IBUS12
  Top 0.406: IBUS.9 132.08,10.16 125.73,16.51 102.87,16.51 96.52,22.86 IC2.7
IBUS13
  Top 0.406: IBUS.11 134.62,10.16 127,17.78 102.87,17.78 97.79,22.86 97.79,29.21 96.52,30.48 IC2.14
IBUS14
  Top 0.406: IBUS.13 137.16,10.16 128.27,19.05 102.87,19.05 99.06,22.86 IC2.8
IBUS15
  Top 0.406: IBUS.15 139.7,10.16 129.54,20.32 102.87,20.32 100.33,22.86 100.33,29.21 99.06,30.48 IC2.13
INTS  (via drill 0.6)
  Top 0.406: R2.2 16.51,69.85 16.51,87.63 v19.05,90.17 | v59.69,90.17 97.79,90.17 99.06,88.9 IC8.9
  Bottom 0.406: v19.05,90.17 20.32,91.44 50.8,91.44 52.07,90.17 v59.69,90.17
MAR0
  Top 0.406: IC1.2 116.84,29.21 115.57,30.48 115.57,48.26 116.84,49.53 IC6.2 116.84,55.88 118.11,57.15 118.11,62.23 116.84,63.5 116.84,72.39 120.65,76.2 120.65,87.63 116.84,91.44 MAR.1
MAR1  (via drill 0.6)
  Top 0.406: IC1.19 116.84,46.99 118.11,48.26 118.11,54.61 119.38,55.88 120.65,55.88 121.92,57.15 IC6.17 | v118.11,64.77 118.11,72.39 119.38,73.66 121.92,76.2 121.92,87.63 118.11,91.44 118.11,93.98 MAR.2
  Bottom 0.406: IC6.17 121.92,63.5 120.65,64.77 v118.11,64.77
MAR2  (via drill 0.6)
  Top 0.406: IC1.5 124.46,29.21 123.19,30.48 123.19,46.99 121.92,48.26 IC6.4 | v119.38,63.5 119.38,72.39 123.19,76.2 123.19,87.63 119.38,91.44 MAR.3
  Bottom 0.406: IC6.4 121.92,55.88 120.65,57.15 120.65,62.23 v119.38,63.5
MAR3  (via drill 0.6)
  Top 0.406: IC1.16 124.46,46.99 125.73,48.26 125.73,55.88 127,57.15 IC6.15 | MAR.4 120.65,93.98 120.65,91.44 124.46,87.63 124.46,76.2 121.92,73.66 121.92,66.04 v123.19,64.77
  Bottom 0.406: IC6.15 127,60.96 v123.19,64.77
  other vias: 127,59.69
MAR4  (via drill 0.6)
  Top 0.406: IC1.6 127,29.21 125.73,30.48 125.73,45.72 127,46.99 IC6.6 | MAR.5 121.92,91.44 125.73,87.63 125.73,76.2 123.19,73.66 v123.19,67.31
  Bottom 0.406: IC6.6 127,55.88 128.27,57.15 128.27,62.23 v123.19,67.31
  other vias: 127,52.07
MAR5  (via drill 0.6)
  Top 0.406: IC1.15 127,44.45 130.81,48.26 130.81,55.88 132.08,57.15 IC6.13 | MAR.6 123.19,93.98 123.19,91.44 127,87.63 127,76.2 125.73,74.93 v125.73,67.31
  Bottom 0.406: IC6.13 132.08,60.96 v125.73,67.31
  other vias: 132.08,59.69
MAR6  (via drill 0.6)
  Top 0.406: IC1.9 134.62,30.48 133.35,31.75 133.35,46.99 132.08,48.26 IC6.8 | MAR.7 124.46,91.44 128.27,87.63 128.27,76.2 127,74.93 127,68.58 v128.27,67.31
  Bottom 0.406: IC6.8 132.08,55.88 133.35,57.15 133.35,62.23 v128.27,67.31
  other vias: 132.08,52.07
MAR7  (via drill 0.6)
  Top 0.406: IC1.12 134.62,46.99 135.89,48.26 135.89,55.88 137.16,57.15 IC6.11 | v128.27,69.85 128.27,74.93 129.54,76.2 129.54,87.63 125.73,91.44 125.73,93.98 MAR.8 124.46,96.52 123.19,97.79 96.52,97.79 95.25,96.52 95.25,93.98 93.98,92.71 59.69,92.71 57.15,90.17 IC4.13
  Bottom 0.406: IC6.11 137.16,60.96 v128.27,69.85
MAR8  (via drill 0.6)
  Top 0.406: IC2.2 83.82,29.21 82.55,30.48 v82.55,40.64 82.55,48.26 83.82,49.53 IC7.2 83.82,54.61 85.09,55.88 86.36,55.88 87.63,57.15 87.63,63.5 88.9,64.77 93.98,64.77 101.6,72.39 107.95,72.39 111.76,76.2 111.76,83.82 v113.03,85.09
  Bottom 0.406: MAR.9 127,91.44 124.46,88.9 115.57,88.9 113.03,86.36 v113.03,85.09 | IC3.2 55.88,44.45 59.69,40.64 v82.55,40.64
MAR9  (via drill 0.6)
  Top 0.406: IC2.19 v83.82,41.91 83.82,45.72 85.09,46.99 85.09,53.34 86.36,54.61 87.63,54.61 88.9,55.88 IC7.17 88.9,62.23 90.17,63.5 93.98,63.5 101.6,71.12 107.95,71.12 113.03,76.2 v113.03,82.55
  Bottom 0.406: MAR.10 125.73,93.98 125.73,91.44 124.46,90.17 115.57,90.17 111.76,86.36 111.76,83.82 v113.03,82.55 | IC3.3 58.42,44.45 60.96,41.91 v83.82,41.91
MAR10  (via drill 0.6)
  Top 0.406: IC2.5 91.44,29.21 90.17,30.48 90.17,35.56 88.9,36.83 v88.9,39.37 IC7.4 | v86.36,63.5 88.9,66.04 93.98,66.04 101.6,73.66 107.95,73.66 110.49,76.2 110.49,85.09 111.76,86.36 v118.11,86.36
  Bottom 0.406: MAR.11 129.54,91.44 124.46,86.36 v118.11,86.36 | v86.36,63.5 87.63,62.23 87.63,57.15 88.9,55.88 IC7.4 | IC3.5 63.5,44.45 64.77,43.18 85.09,43.18 v88.9,39.37
MAR11  (via drill 0.6)
  Top 0.406: IC2.16 91.44,39.37 v93.34,41.27 95.25,43.18 95.25,55.88 93.98,57.15 IC7.15 93.98,62.23 101.6,69.85 107.95,69.85 114.3,76.2 v114.3,83.82
  Bottom 0.406: MAR.12 128.27,93.98 128.27,91.44 124.46,87.63 115.57,87.63 114.3,86.36 v114.3,83.82 | IC3.6 66.04,45.72 67.31,44.45 86.36,44.45 89.53,41.27 v93.34,41.27
MAR12  (via drill 0.6)
  Top 0.406: IC7.6 93.98,44.45 90.17,40.64 v90.17,38.1 | v97.79,63.5 101.6,63.5 102.87,64.77 102.87,66.04 104.14,67.31 107.95,67.31 116.84,76.2 v116.84,83.82
  Bottom 0.406: IC2.6 93.98,26.67 90.17,30.48 v90.17,38.1 | MAR.13 132.08,91.44 124.46,83.82 v116.84,83.82 | IC7.6 93.98,55.88 95.25,57.15 95.25,62.23 96.52,63.5 v97.79,63.5 96.52,64.77 78.74,64.77 73.66,59.69 IC3.8
MAR13  (via drill 0.6)
  Top 0.406: IC2.15 93.98,36.83 96.52,39.37 99.06,39.37 100.33,40.64 100.33,55.88 99.06,57.15 IC7.13 | v100.33,66.04 102.87,68.58 107.95,68.58 115.57,76.2 v115.57,85.09 | IC3.9 66.04,63.5 v68.58,66.04
  Bottom 0.406: MAR.14 130.81,93.98 130.81,91.44 124.46,85.09 v115.57,85.09 | IC7.13 99.06,64.77 v100.33,66.04 v68.58,66.04
MAR14  (via drill 0.6)
  Top 0.406: v97.79,40.64 99.06,41.91 IC7.8 | v105.41,63.5 106.68,64.77 107.95,64.77 119.38,76.2 v119.38,81.28 | IC3.11 v60.96,66.04
  Bottom 0.406: IC2.9 101.6,26.67 97.79,30.48 v97.79,40.64 | MAR.15 134.62,91.44 124.46,81.28 v119.38,81.28 | IC7.8 99.06,54.61 100.33,55.88 101.6,55.88 | 101.6,55.88 104.14,55.88 105.41,57.15 v105.41,63.5 | v60.96,66.04 62.23,67.31 101.6,67.31 102.87,66.04 102.87,57.15 101.6,55.88
MAR15  (via drill 0.6)
  Top 0.406: IC2.12 101.6,36.83 106.68,41.91 106.68,54.61 104.14,57.15 IC7.11 104.14,64.77 105.41,66.04 107.95,66.04 118.11,76.2 v118.11,82.55 | IC3.12 58.42,66.04 v59.69,67.31
  Bottom 0.406: MAR.16 133.35,93.98 133.35,91.44 124.46,82.55 v118.11,82.55 | v59.69,67.31 60.96,68.58 102.87,68.58 104.14,67.31 IC7.11
N$1
  Top 0.406: IC4.1 54.61,57.15 53.34,55.88 IC3.1
N$2
  Top 0.406: IC4.2 57.15,57.15 58.42,55.88 59.69,55.88 60.96,54.61 IC3.4
N$3
  Top 0.406: IC4.4 62.23,63.5 63.5,62.23 IC3.10
N$4
  Top 0.406: IC3.13 55.88,80.01 57.15,81.28 63.5,81.28 64.77,80.01 IC4.5
N$5  (via drill 0.6)
  Top 0.406: IC5.3 31.75,80.01 33.02,81.28 34.29,81.28 35.56,82.55 35.56,88.9 39.37,92.71 v52.07,92.71
  Bottom 0.406: v52.07,92.71 53.34,91.44 66.04,91.44 69.85,87.63 IC4.8
N$6
  Bottom 0.406: INT_SEEN.K 6.35,69.85 8.89,67.31 R2.1
N$7
  Bottom 0.406: INTS_ALLOWED.K 6.35,73.66 8.89,76.2 R1.1
RESET_AND_CLI  (via drill 0.6)
  Top 0.406: IC5.14 31.75,88.9 36.83,93.98 52.07,93.98 v53.34,95.25 | IC8.15 83.82,83.82 82.55,82.55 82.55,68.58 74.93,60.96 v74.93,36.83 | v67.31,35.56 67.31,30.48 66.04,29.21 IC9.6
  Bottom 0.406: v53.34,95.25 54.61,95.25 55.88,93.98 68.58,93.98 73.66,88.9 82.55,88.9 83.82,87.63 IC8.15 | v67.31,35.56 73.66,35.56 v74.93,36.83
VCC
  pour Top (isolate 0.508, no thermals): 20.32,8.89 19.05,7.62 19.05,5.08 20.32,3.81 22.86,3.81 24.13,5.08 24.13,7.62 22.86,8.89
  pour Top (isolate 0.61, rank 6, no thermals): 0,100.33 0,0 160.02,0 160.02,100.33

### Text on the board
Top: (c) 2011 AlexiosC
Bottom: (c) 2011 AlexiosC
tNames: http://www.bedroomlan.org/hardware/cft | (c) 2011 AlexiosC | CFT CPU MAR/INT/AIL rev B
tValues: +12V | +5V | GND